# EAGLE design LT1054_Daughterboard (EAGLE 9.6.2)
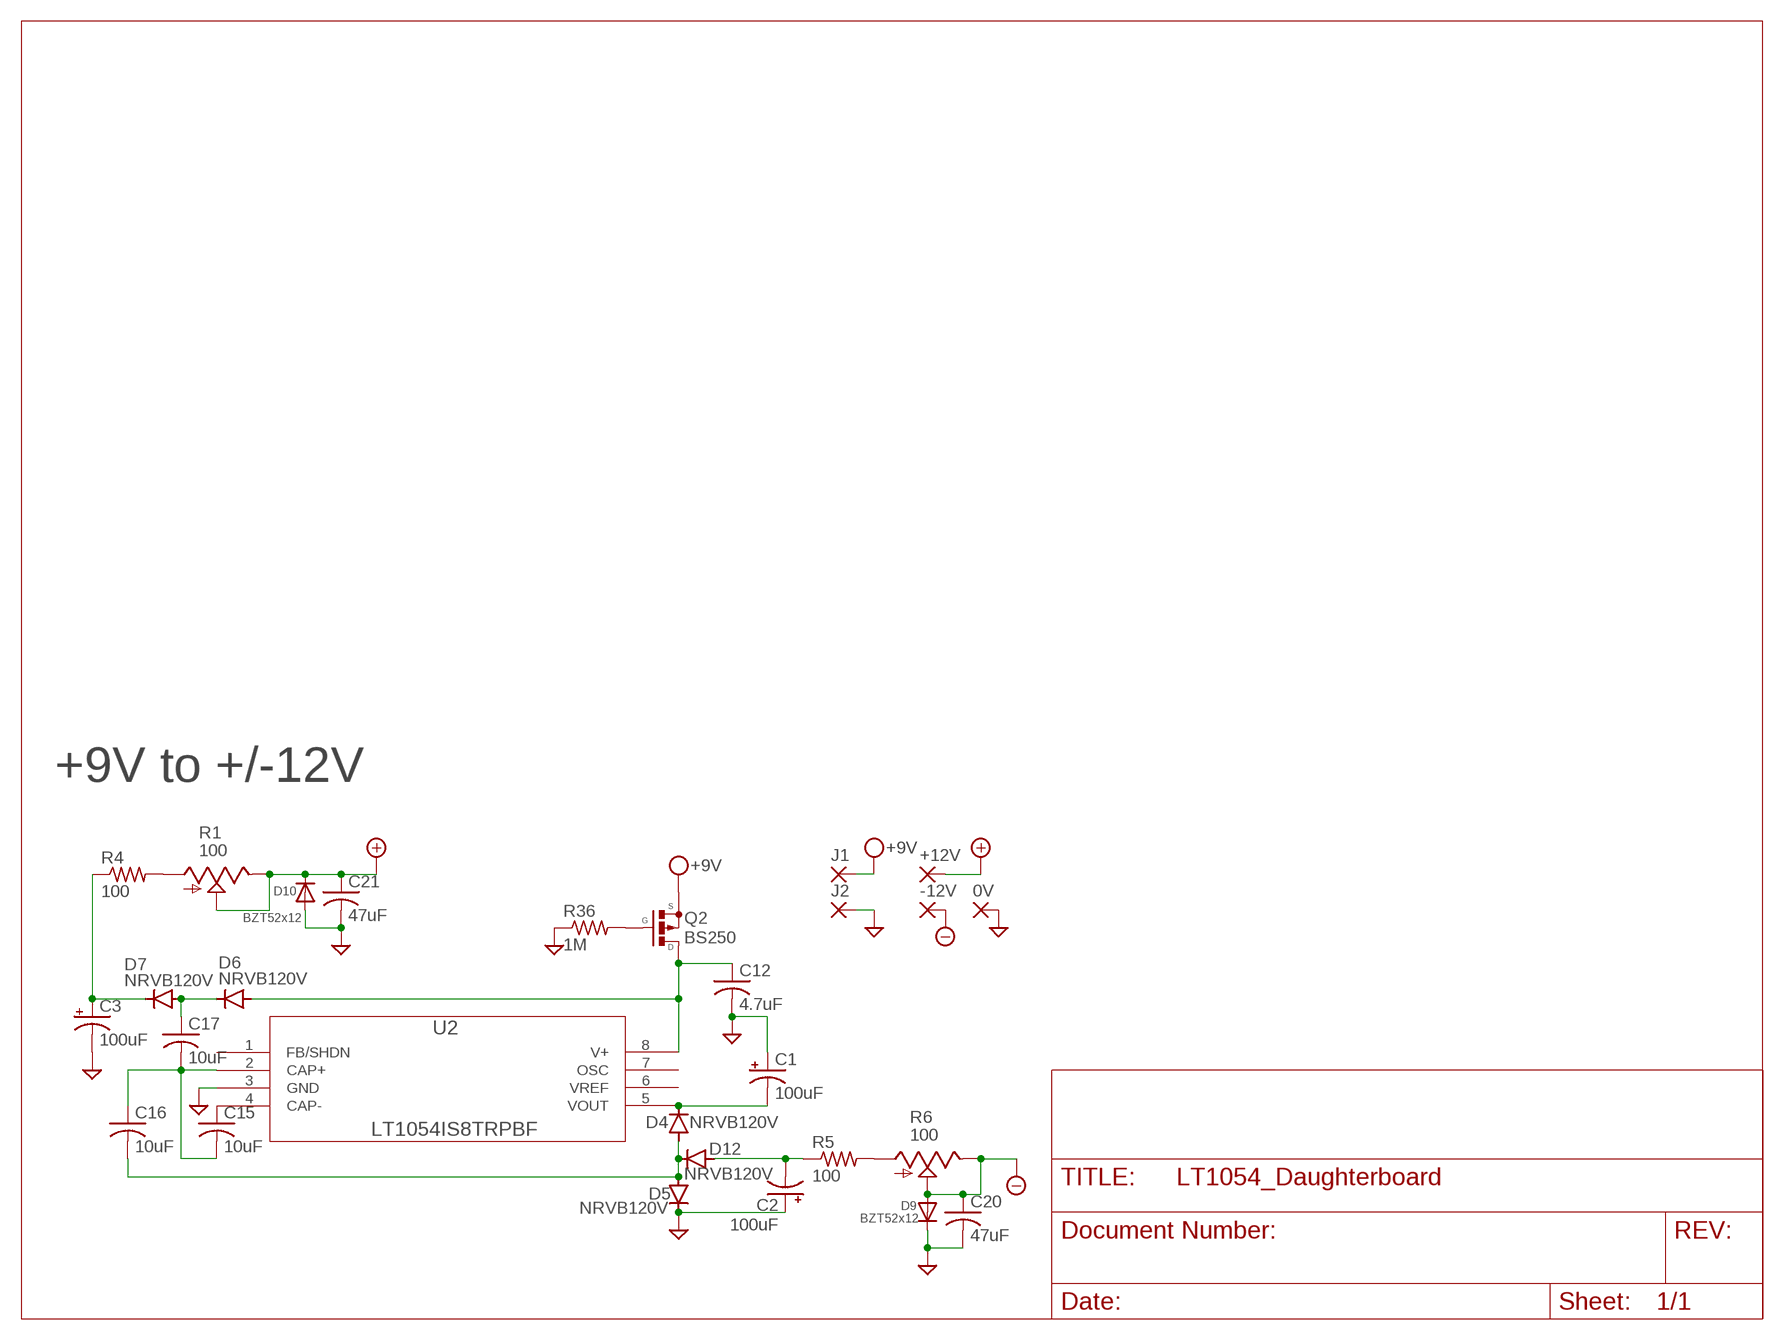
[diagram p0: schematic, sheet 1]

## Parts
0V  SMD2  [SMD1,27-2,54]
+12V  SMD2  [SMD1,27-2,54]
-12V  SMD2  [SMD1,27-2,54]
C1  100uF  CPOL-USE2,5-6E  [E2,5-6E]
C2  100uF  CPOL-USE2,5-6E  [E2,5-6E]
C3  100uF  CPOL-USE2,5-6E  [E2,5-6E]
C12  4.7uF  C-USC0805  [C0805]
C15  10uF  C-USC1206  [C1206]
C16  10uF  C-USC1206  [C1206]
C17  10uF  C-USC1206  [C1206]
C20  47uF  C-USC1206  [C1206]
C21  47uF  C-USC1206  [C1206]
D4  NRVB120V  DIODE-SOD123  [SOD123]
D5  NRVB120V  DIODE-SOD123  [SOD123]
D6  NRVB120V  DIODE-SOD123  [SOD123]
D7  NRVB120V  DIODE-SOD123  [SOD123]
D9  BZT52x12  DIODESOD-123  [SOD-123]
D10  BZT52x12  DIODESOD-123  [SOD-123]
D12  NRVB120V  DIODE-SOD123  [SOD123]
J1  SMD2  [SMD1,27-2,54]
J2  1,6/0,8  [1,6/0,8]
Q2  BS250  BS250BS250-SOT23-GSD  [SOT23]
R1  100  TRIM_US-3223G  [3223G]
R4  100  R-US_R1206  [R1206]
R5  100  R-US_R1206  [R1206]
R6  100  TRIM_US-3223G  [3223G]
R36  1M  R-US_R0805  [R0805]
U2  LT1054IS8TRPBF  [SO-8_S]

## Nets
+12V: +12V.1(P) C21.1 D10.C R1.2(S) R1.3(E)
-12V: -12V.1(P) C20.1 D9.A R6.2(S) R6.3(E)
GND: 0V.1(P) C1.+ C2.+ C3.- C12.2 C20.2 C21.2 D5.C D9.C D10.A J2.1(P) R36.1 U2.3(GND)
N$1: R1.1(A) R4.2
N$2: R5.2 R6.1(A)
N$16: Q2.G R36.2
N$17: C12.1 D6.A Q2.D U2.8(V+)
N$18: C1.- D4.C U2.5(VOUT)
N$19: C16.2 D4.A D5.A D12.C
N$20: C2.- D12.A R5.1
N$22: C15.1 U2.4(CAP-)
N$23: C15.2 C16.1 C17.2 U2.2(CAP+)
N$24: C17.1 D6.C D7.A
N$25: C3.+ D7.C R4.1
VCC: J1.1(P) Q2.S ; supply symbol labelled +9V
Unconnected: U2.1(FB/SHDN) U2.7(OSC)

## Notes on the sheet
- +9V to +/-12V

## Power pins joined to a net without a drawn wire
VREF: U2.6(VREF)

## Library data of the parts
0V +12V -12V J1 = wirepad:SMD2: SMD PAD
C1-C3 = rcl:CPOL-US: POLARIZED CAPACITOR, American symbol; SPICEPREFIX: C
C12 C15-C17 C20 C21 = adafruit:C-US: CAPACITOR, American symbol
D4-D7 D12 = diode:DIODE-: DIODE
D9 D10 = adafruit:DIODE: Diode SMADIODE - SMA Surface Mount Package 20V 1A Schottky Diode Digikey: 641-1014-6-ND DO-1N4148 - Through Hole Small Current Diode SOD-123 20V 1 A (.5mV Vf) Schottky Diode - Digikey: MBRX120TPMSCT-ND SOD-323 10V 570mA (.38mV Vf, 3ns) Schottky Diode - Digikey: ZLLS410CT-ND SOD-523 30V 30mA Schottky Diode (RB751S-40TE61) - Digikey: RB751S-40TE61CT-ND SOT23-R/W - SOT23 Package (R = Solder Paste/Reflow Ovens, W = Hand-Soldering) BAT54Film 40V 300mA - Digikey: 497-7162-1-ND
J2 = wirepad:1,6/0,8: THROUGH-HOLE PAD
Q2 = transistors-FET:BS250: P-Channel Mosfet [D]-G-S pinout BS250: http://smallbear-electronics.mybigcommerce.com/transistor-fet-bs250/
R1 R6 = pot:TRIM_US-: POTENTIOMETER
R4 R5 R36 = adafruit:R-US_: RESISTOR, American symbol
U2 = LT1054IS8TRPBF:LT1054IS8TRPBF: Check prices <https://pricing.snapeda.com/search/part/LT1054IS8%23TRPBF/?ref=eda>; AVAILABILITY: Warning; DESCRIPTION: Charge Pump INV/STPUP 100mA 8-Pin SOIC N T/R; MF: Analog Devices; MP: LT1054IS8#TRPBF; PACKAGE: SOIC -8 Analog Devices; PRICE: None; PURCHASE-URL: https://pricing.snapeda.com/search/part/LT1054IS8#TRPBF/?ref=eda

## Board
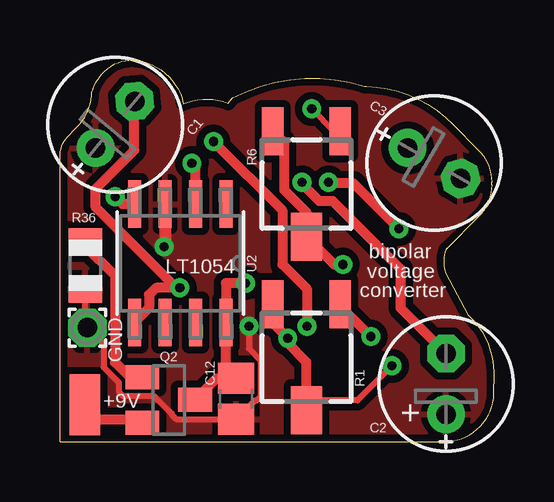
[diagram p1: board, top side]
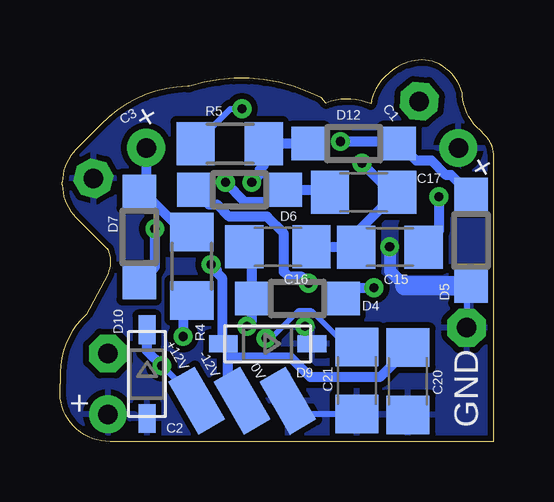
[diagram p2: board, bottom side, seen from below]

Size 18.1 x 15.9 mm. Coordinates in mm from the lower left corner, seen from the top.
Outline: 0,0 16,0 arc90 18.1,2 18.1,2.4 18.1,2.87 arc45 17.01,5.29 16.1,7 arc-45 16.1,7.98 16.1,8 arc-45 16.15,8.05 17.43,9.33 arc45 18,10.7 18,10.8 arc45 17.43,12.17 16.4,13.2 arc45 12.78,14.8 12.72,14.8 arc45 12.7,14.8 arc45 7.2,14.32 7,14.1 arc45 5.13,14.07 5.1,14.3 arc45 3.85,15.7 3.58,15.8 arc45 2.29,15.73 arc45 1.32,14.54 1.32,14.43 arc-45 0.57,12.96 0.38,12.77 arc45 0,11.85 0,0
Copper layers (1*16): Top 0.035mm / dielectric 1.5mm / Bottom 0.035mm
Design rules "default *": minimum track width 6mil, minimum drill 0.35mm, track to track 6mil, track to pad 6mil, pad to pad 6mil, via to via 6mil, smd to smd 6mil, copper to edge 10mil, drill to drill 6mil, minimum pad ring 10mil, minimum via ring 8mil, stop-mask expansion 4mil, vias tented up to drill 0mil, thermal gap 10mil

### Footprints (pad centres in the part's own frame; a part is rotated, then mirrored left to right if it is on the bottom)
SMD1,27-2,54 = smd 1.27 x 2.54: 1 0,0
E2,5-6E = drill 0.813 pad 1.575: + -1.27,0 | drill 0.813 pad 1.575 octagon: - 1.27,0
C0805 = smd 1.3 x 1.5: 1 -0.85,0; 2 0.85,0
C1206 = smd 1.6 x 1.8: 1 -1.4,0; 2 1.4,0
SOD123 = smd 1.4 x 1.4: A 1.9,0; C -1.9,0
SOD-123 = smd 1.2 x 0.7: A 1.85,0; C -1.85,0
1,6/0,8 = drill 0.813 pad 1.6 octagon: 1 0,0
SOT23 = smd 1 x 1.4: D 0,1.1; G -0.95,-1.1; S 0.95,-1.1
3223G = smd 2 x 0.9: 1 -2.2,1.4; 3 -2.2,-1.4 | smd 2 x 1.3: 2 2.2,0
R1206 = smd 1.6 x 1.803: 1 -1.422,0; 2 1.422,0
R0805 = smd 1.1 x 1.4: 1 -1,0; 2 1,0
SO-8_S = smd 1.981 x 0.533: 1 -2.464,1.905; 2 -2.464,0.635; 3 -2.464,-0.635; 4 -2.464,-1.905; 5 2.464,-1.905; 6 2.464,-0.635; 7 2.464,0.635; 8 2.464,1.905

### Placement (x,y rotation side)
0V  8.6,1.7 30 bottom
+12V  12.4,1.7 30 bottom
-12V  10.5,1.7 30 bottom
C1  2.3,13.2 50 top
C2  16.1,2.4 90 top
C3  15.6,11.6 330 top
C12  7.34,1.78 270 top
C15  4.34,8.1 180 bottom
C16  9.01,8.11 180 bottom
C17  5.44,10.39 0 bottom
C20  3.59,2.51 270 bottom
C21  5.71,2.54 270 bottom
D4  8.19,5.96 180 bottom
D5  0.96,8.38 90 bottom
D6  10.61,10.49 180 bottom
D7  14.79,8.52 270 bottom
D9  9.44,4.07 180 bottom
D10  14.47,2.81 270 bottom
D12  5.85,12.41 180 bottom
J1  1.05,1.54 180 top
J2  1.14,4.74 0 top
Q2  4.54,1.73 270 top
R1  10.28,3.51 270 top
R4  12.6,7.3 270 bottom
R5  11.02,12.41 180 bottom
R6  10.28,10.73 270 top
R36  1.06,7.34 90 top
U2  5.02,7.43 270 top

### Tracks (layer width: path | path; a pad name or v marks a point on that pad's centre or on a via)
+12V  (via drill 0.38)
  Top 0.254: v13.85,3.15 +12V.1 10.68,1.71
  Top 0.406: 10.68,1.71 R1.2 10.28,3.31 9.5,4.09 v9.5,4.3 8.88,4.92 R1.3
  Bottom 0.203: C21.1 6.07,4.3 6.47,4.3 7.62,5.45 8.15,5.45 9.3,4.3 v9.5,4.3
  Bottom 0.254: +12V.1 v13.85,3.15
  Bottom 0.406: v13.85,3.15 14.47,3.77 D10.C
-12V  (via drill 0.38)
  Top 0.406: v11.8,7.38 11.43,7.38 R6.2 10.28,9.56 9.35,10.49 9.35,12.46 R6.3
  Bottom 0.406: 11,3.7 11.1,3.7 11.1,2.3 -12V.1 | C20.1 3.59,3.86 4.76,2.68 7.66,2.68 8.47,3.5 10.8,3.5 11,3.7 | 11,3.7 11.29,3.99 D9.A 11.34,4.07 11.34,6.83 11.57,7.05 11.57,7.14 v11.8,7.38
GND  (via drill 0.38)
  Top 0.254: R36.1 1.06,4.82 J2.1 1.82,4.06 1.82,3.1 2.46,2.46 2.46,2.07 2.62,1.9 3.91,1.9 4.66,1.16 4.66,1.12 4.84,0.93 C12.2 8.11,1.7 8.21,1.7 8.37,1.86 8.37,3.4 7.88,3.88 v7.88,4.8
  Top 0.508: U2.3 4.38,8.14 v4.35,8.11
  Bottom 0.254: C21.2 8.04,1.14 0V.1 | 4.32,8.08 v4.35,8.11 | D5.C 1.14,6.3 J2.1 | D9.C 7.88,4.36 v7.88,4.8
  Bottom 0.508: 4.32,8.08 4.32,7.08 3.71,6.48
  Bottom 0.813: D5.C 3.71,6.48
  pour Top (isolate 0.305): -1,16 -1,-1 19,-1 19,16
  pour Bottom (isolate 0.254): -1,16 -1,-1 19,-1 19,16
N$1  (via drill 0.38)
  Top 0.406: v12.96,4.37 11.68,5.66 R1.1
  Bottom 0.406: R4.2 12.96,5.52 v12.96,4.37
N$2  (via drill 0.38)
  Top 0.254: v10.5,13.86 11.43,12.93 R6.1
  Bottom 0.254: R5.2 10.99,13.86 v10.5,13.86
N$16
  Top 0.406: R36.2 1.06,8.14 2.3,6.9 2.3,3.3 2.92,2.68 Q2.G
N$17  (via drill 0.38)
  Top 0.406: Q2.D 6.53,2.63 C12.1 6.92,3.04 U2.8 6.92,6.6 v7.74,6.6
  Bottom 0.406: D6.A 11.9,9.88 11.55,9.88 11.04,9.37 9.46,9.37 8.77,8.67 8.77,7.06 8.56,6.85 7.99,6.85 v7.74,6.6
N$18  (via drill 0.38)
  Top 0.406: U2.5 3.71,5.57 3.71,6.12 4,6.4 v5,6.4 4.85,6.4 1.49,9.76 1.49,10.53 3.1,12.14 3.1,14.16 C1.-
  Bottom 0.406: D4.C 6.29,6.01 5.9,6.4 v5,6.4
N$19  (via drill 0.38)
  Top 0.406: v6.4,12.5 9.27,9.63 9.27,7.38 10.3,6.36 v10.3,4.8
  Bottom 0.406: D5.A 1.78,11.1 2,11.1 2.61,11.71 3.25,11.71 D12.C 4.04,12.5 v6.4,12.5 | C16.2 10.09,7.79 D4.A 10.09,5.01 v10.3,4.8
N$20  (via drill 0.38)
  Top 0.406: C2.- 14.21,5.56 14.21,7.18 11.38,10.02 10.82,10.02 10.1,10.74 v10.1,10.8
  Bottom 0.406: D12.A R5.1 9.6,11.51 9.77,11.34 9.77,11.13 v10.1,10.8
N$22  (via drill 0.38)
  Top 0.406: U2.4 2.61,9.89 v2.3,10.2
  Bottom 0.406: v2.3,10.2 2.3,8.74 C15.1
N$23  (via drill 0.38)
  Top 0.406: U2.2 5.66,11.45 v5.5,11.6
  Bottom 0.406: C16.1 C15.2 5.74,8.69 C17.2 4.29,10.39 v5.5,11.6
N$24  (via drill 0.38)
  Top 0.406: v14.14,8.86 12.24,10.76 11.24,10.76 v11.2,10.8
  Bottom 0.406: C17.1 6.94,10.49 D6.C 9.2,10 10.4,10 v11.2,10.8 | D7.A 14.14,7.27 v14.14,8.86
N$25
  Bottom 0.406: R4.1 13.01,9.13 13.36,9.13 14.64,10.42 D7.C 14.5,10.71 C3.+
VCC
  Top 0.406: Q2.S 3.32,0.9 1.1,0.9 1.05,0.95 J1.1

### Text on the board
tPlace: bipolar | LT1054 | voltage | converter | GND | +9V | +
bPlace: + | + | GND | +
bNames: C1 | C3 | C2